# Altium schematic sheet DRIVER_GATE_BOARD_solar_boost_converter.SchDoc
size A0; SheetNumber: 1; SheetTotal: 1; SPICEModelCacheYQEDCYZF: <root> / <DocumentId>YQEDCYZF</DocumentId> / </root>
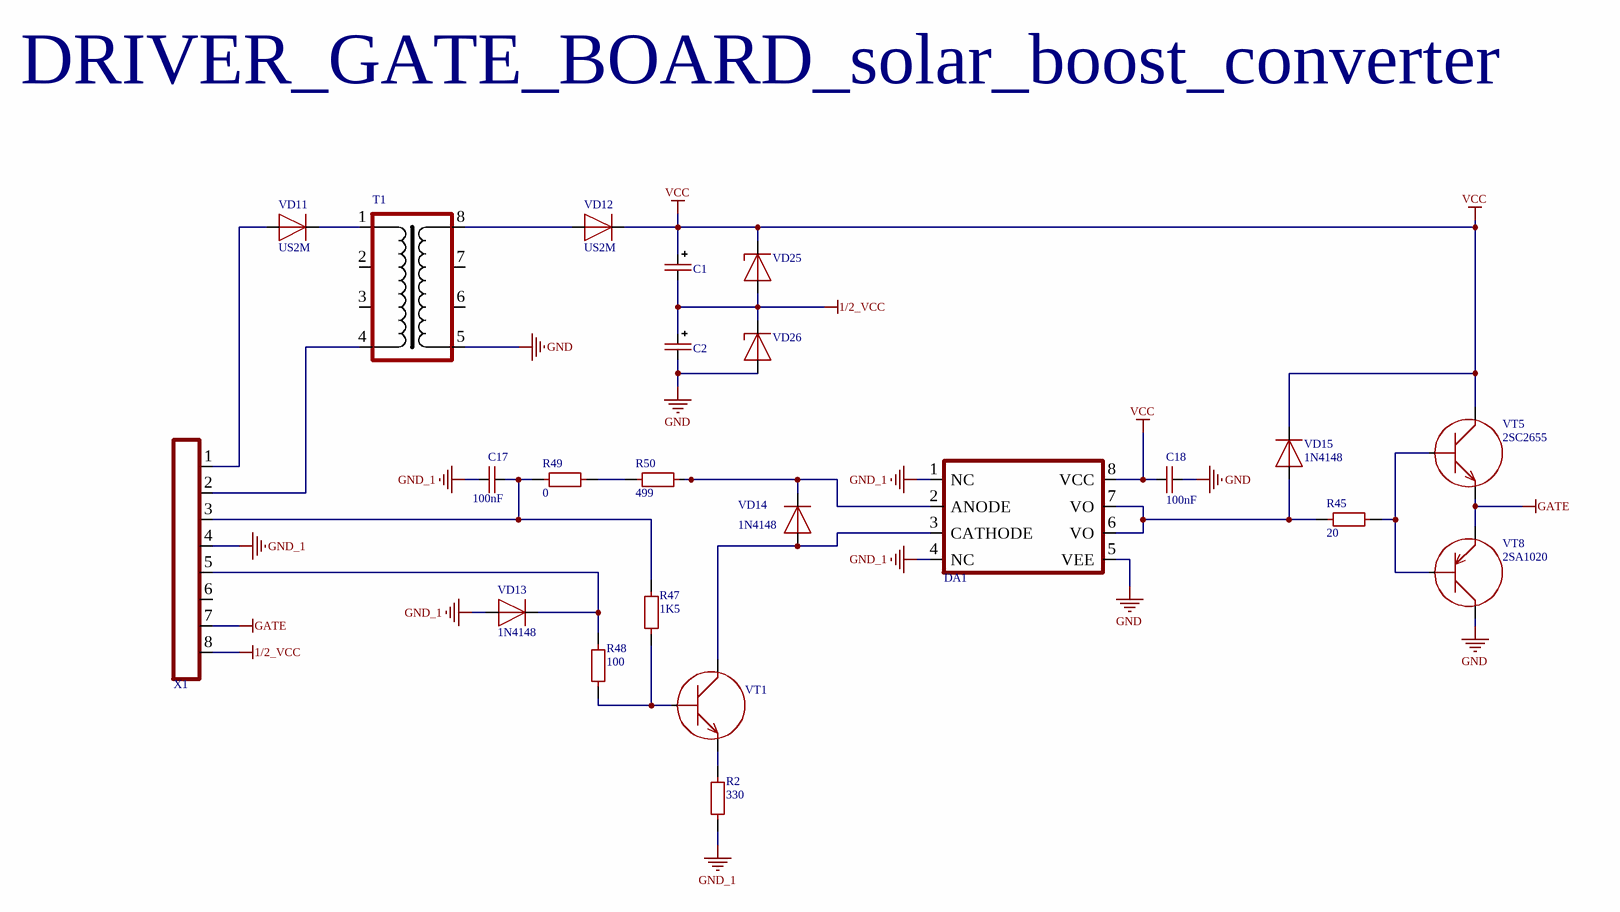
[diagram p0: DRIVER_GATE_BOARD_solar_boost_converter.SchDoc]

## Parts
C1  CAP-POLAR  [CAP-TAN-C]  (value not drawn)
C2  CAP-POLAR  [CAP-TAN-C]  (value not drawn)
C17  100nF  [CAP-0805]
C18  100nF  [CAP-0805]
DA1  ACPL-T350  [ACPL-T350]  (value not drawn)
R2  330  [RES-0805]
R45  20  [RES-0805]
R47  1K5  [RES-0805]
R48  100  [RES-0805]
R49  0  [RES-0805]
R50  499  [RES-0805]
T1  TRANS_EE10  [TRANS_EE10]  (value not drawn)
VD11  US2M  [DO-214AC, SMA]
VD12  US2M  [DO-214AC, SMA]
VD13  1N4148  [SOD-123]
VD14  1N4148  [SOD-123]
VD15  1N4148  [SOD-123]
VD25  (no value)  [SOD-80]
VD26  (no value)  [SOD-80]
VT1  BC847-BEC  [SOT23-3]  (value not drawn)
VT5  2SC2655  [SOT-89]
VT8  2SA1020  [SOT-89]
X1  CONN-8-PIN  [CONN-PLS-8-2.54mm]  (value not drawn)

## Nets
1/2_VCC: C1.2(-) C2.1(+) VD25.2(A) VD26.1(C) X1.8
GATE: VT5.3(E) VT8.3(E) X1.7
GND: C2.2(-) C18.2 DA1.5(VEE) T1.5 VD26.2(A) VT8.2(C)
GND_1: C17.1 DA1.1(NC) DA1.4(NC) R2.2 VD13.2(A) X1.4
VCC: C1.1(+) C18.1 DA1.8(VCC) VD12.1(C) VD15.1(C) VD25.1(C) VT5.2(C)
NetC17_2: C17.2 R47.2 R49.2 X1.3
NetDA1_2: DA1.2(ANODE) R50.1 VD14.1(C)
NetDA1_3: DA1.3(CATHODE) VD14.2(A) VT1.3(C)
NetDA1_6: DA1.6(VO) DA1.7(VO) R45.1 VD15.2(A)
NetR2_1: R2.1 VT1.2(E)
NetR45_2: R45.2 VT5.1(B) VT8.1(B)
NetR47_1: R47.1 R48.2 VT1.1(B)
NetR48_1: R48.1 VD13.1(C) X1.5
NetR49_1: R49.1 R50.2
NetT1_1: T1.1 VD11.1(C)
NetT1_4: T1.4 X1.2
NetT1_8: T1.8 VD12.2(A)
NetVD11_2: VD11.2(A) X1.1

Not connected (* = marked no-connect by the designer): T1 2 3 6 7; X1 6

## Notes on the sheet
- DRIVER_GATE_BOARD_solar_boost_converter

## Library data of the parts
C17 C18 = CAP-NON-POLAR
R2 R45 R47-R50 = RES-CONST
VD11-VD15 = DIODE
VD25 VD26 = ZENER
VT5 = BIPOLAR-NPN-BEC
VT8 = BIPOLAR-PNP-BCE